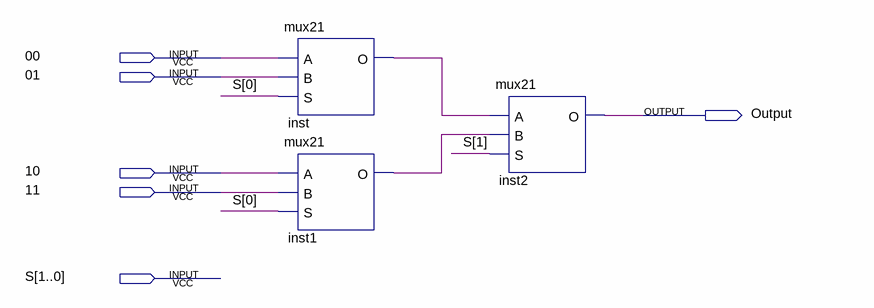
[diagram p0: schematic sheet]
// Quartus schematic Mux41.bdf as structural Verilog: 3 symbols, 6 pins
module Mux41 (
  input  \00 ,
  input  \01 ,
  input  \10 ,
  input  \11 ,
  input  [1:0] S,
  output Output
);

  wire inst1_o, inst_o;

  mux21 inst (.A(\00 ), .B(\01 ), .S(S[0]), .O(inst_o));
  mux21 inst1 (.A(\10 ), .B(\11 ), .S(S[0]), .O(inst1_o));
  mux21 inst2 (.A(inst_o), .B(inst1_o), .S(S[1]), .O(Output));
endmodule
